# Altium schematic sheet AFE_old.SchDoc: AFE
size A4; Date: 24/11/2015; Author: Samuel López; DocumentNumber: 2; SheetNumber: 2; SheetTotal: 2; Project: H2H Main Board
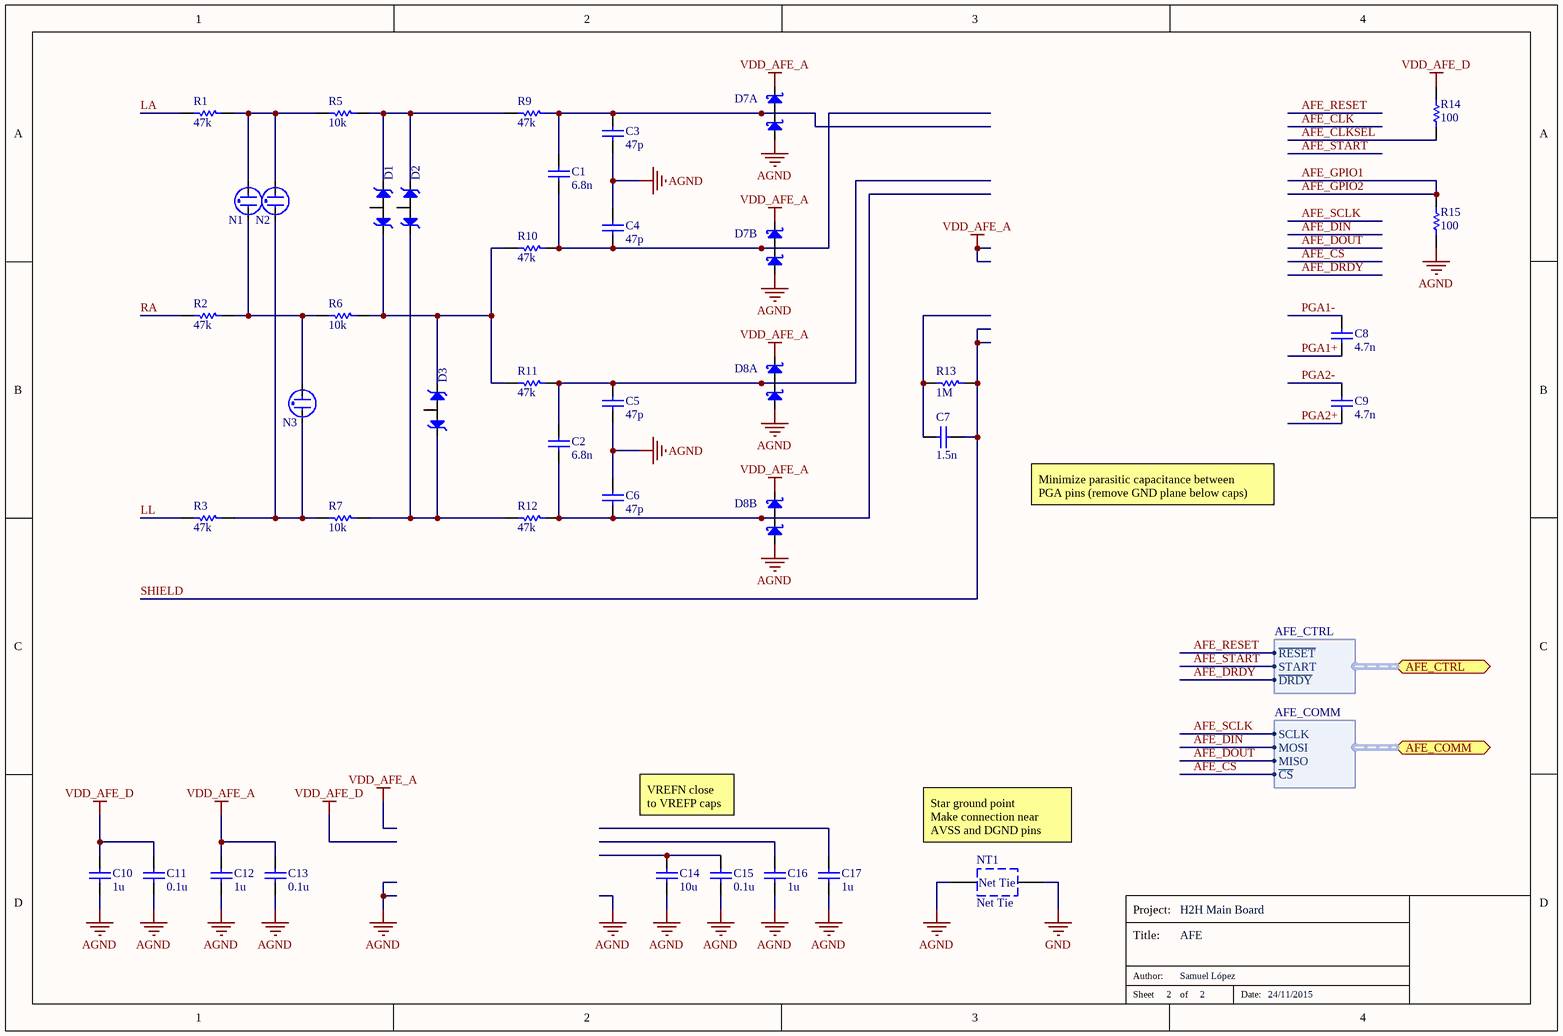
[diagram p0: AFE_old.SchDoc]

## Parts
C1  6.8n  [C0603]
C2  6.8n  [C0603]
C3  47p  [C0603]
C4  47p  [C0603]
C5  47p  [C0603]
C6  47p  [C0603]
C7  1.5n  [C0603]
C8  4.7n  [C0603]
C9  4.7n  [C0603]
C10  1u  [C0603]
C11  0.1u  [C0603]
C12  1u  [C0603]
C13  0.1u  [C0603]
C14  10u  [C0603]
C15  0.1u  [C0603]
C16  1u  [C0603]
C17  1u  [C0603]
D1  PESD5V0X1BT  [SOT23-3]  (value not drawn)
D2  PESD5V0X1BT  [SOT23-3]  (value not drawn)
D3  PESD5V0X1BT  [SOT23-3]  (value not drawn)
D7  BAS70DW-04  [SOT-363]  (value not drawn)  (parts A,B of 2)
D8  BAS70DW-04  [SOT-363]  (value not drawn)  (parts A,B of 2)
N1  GDT  [1812 GDT]  (value not drawn)
N2  GDT  [1812 GDT]  (value not drawn)
N3  GDT  [1812 GDT]  (value not drawn)
NT1  Net Tie  [Net Tie (AGND-DGND)]  (net tie, no BOM)
R1  47k  [R0603]
R2  47k  [R0603]
R3  47k  [R0603]
R5  10k  [R0603]
R6  10k  [R0603]
R7  10k  [R0603]
R9  47k  [R0603]
R10  47k  [R0603]
R11  47k  [R0603]
R12  47k  [R0603]
R13  1M  [R0603]
R14  100  [R0603]
R15  100  [R0603]

## Ports
AFE_COMM (harness AFE_COMM), AFE_CTRL (harness AFE_CTRL)

## Harnesses
AFE_COMM: SCLK, MOSI, MISO, ~{CS}
AFE_CTRL: ~{RESET}, START, ~{DRDY}

## Nets
AGND: C3.2 C4.1 C5.2 C6.1 C10.1 C11.1 C12.1 C13.1 C14.1 C15.1 C16.1 C17.1 D7.1(A1) D7.4(A2) D8.1(A1) D8.4(A2) NT1.1 R15.1
GND: NT1.2
VDD_AFE_A: C12.2 C13.2 D7.2(K1) D7.5(K2) D8.2(K1) D8.5(K2)
VDD_AFE_D: C10.2 C11.2 R14.2
AFE_CLKSEL: R14.1
AFE_CS: port AFE_COMM.~{CS}
AFE_DIN: port AFE_COMM.MOSI
AFE_DOUT: port AFE_COMM.MISO
AFE_DRDY: port AFE_CTRL.~{DRDY}
AFE_GPIO1: R15.2  [also labelled AFE_GPIO2]
AFE_RESET: port AFE_CTRL.~{RESET}
AFE_SCLK: port AFE_COMM.SCLK
AFE_START: port AFE_CTRL.START
LA: R1.1
LL: R3.1
PGA1+: C8.1
PGA1-: C8.2
PGA2+: C9.1
PGA2-: C9.2
RA: R2.1
SHIELD: C7.2 R13.2
NetC1_1: C1.1 C3.1 D7.6(AK1) R9.2
NetC1_2: C1.2 C4.2 D7.3(AK2) R10.2
NetC2_1: C2.1 C5.1 D8.6(AK1) R11.2
NetC2_2: C2.2 C6.2 D8.3(AK2) R12.2
NetC7_1: C7.1 R13.1
NetC14_2: C14.2 C15.2
NetD1_1: D1.1(K1) D3.2(K2) R6.2 R10.1 R11.1
NetD1_2: D1.2(K2) D2.2(K2) R5.2 R9.1
NetD2_1: D2.1(K1) D3.1(K1) R7.2 R12.1
NetN1_1: N1.1 N3.2 R2.2 R6.1
NetN1_2: N1.2 N2.2 R1.2 R5.1
NetN2_1: N2.1 N3.1 R3.2 R7.1

Not connected (* = marked no-connect by the designer): C16 2; C17 2; D1 3(A); D2 3(A); D3 3(A)

## Notes on the sheet
- Minimize parasitic capacitance between
  PGA pins (remove GND plane below caps)
- VREFN close
  to VREFP caps
- (near NT1) Star ground point
  Make connection near AVSS and DGND pins
- Project:
- Title:
- Sheet
- Author:
- of
- Date:

## Library data of the parts
C1-C17 = Capacitor: Rated Voltage: *
  C1 C2: Value: 6.8n
  C3-C6: Value: 47p
  C7: Value: 1.5n
  C8 C9: Value: 4.7n
  C10 C12 C16 C17: Value: 1u
  C11 C13 C15: Value: 0.1u
  C14: Value: 10u
D1-D3 = PESD5V0X1: TVS Diode - Bidirectional; Capacitance: 1 pF; Supplier 1: Digi-Key; Supplier Part Number 1: 568-4676-1-ND
D7 D8 = BAS70DW-04: Schottky Diode - Array; Supplier 1: Digi-Key; Supplier Part Number 1: BAS70DW-04FDICT-ND
N1-N3 = 2051-09-SM: GDT - Gas Discharge Tube; DC Sparkover: 90 V; Impulse Sparkover (1000V/us): <600 V; Glow Voltage: 70 V; Arc Voltage: 10 V; Glow-Arc Transition Current: <1 A; Impulse Sparkover (100V/us): <500 V; Supplier 1: Digi-Key; Supplier Part Number 1: 2051-09-SM-RPLFCT-ND
NT1 = Net Tie: Net Tie (AGND-DGND)
R1-R3 R5-R7 R9-R15 = Resistor: Power: *
  R1-R3 R9-R12: Value: 47k
  R5-R7: Value: 10k
  R13: Value: 1M
  R14 R15: Value: 100